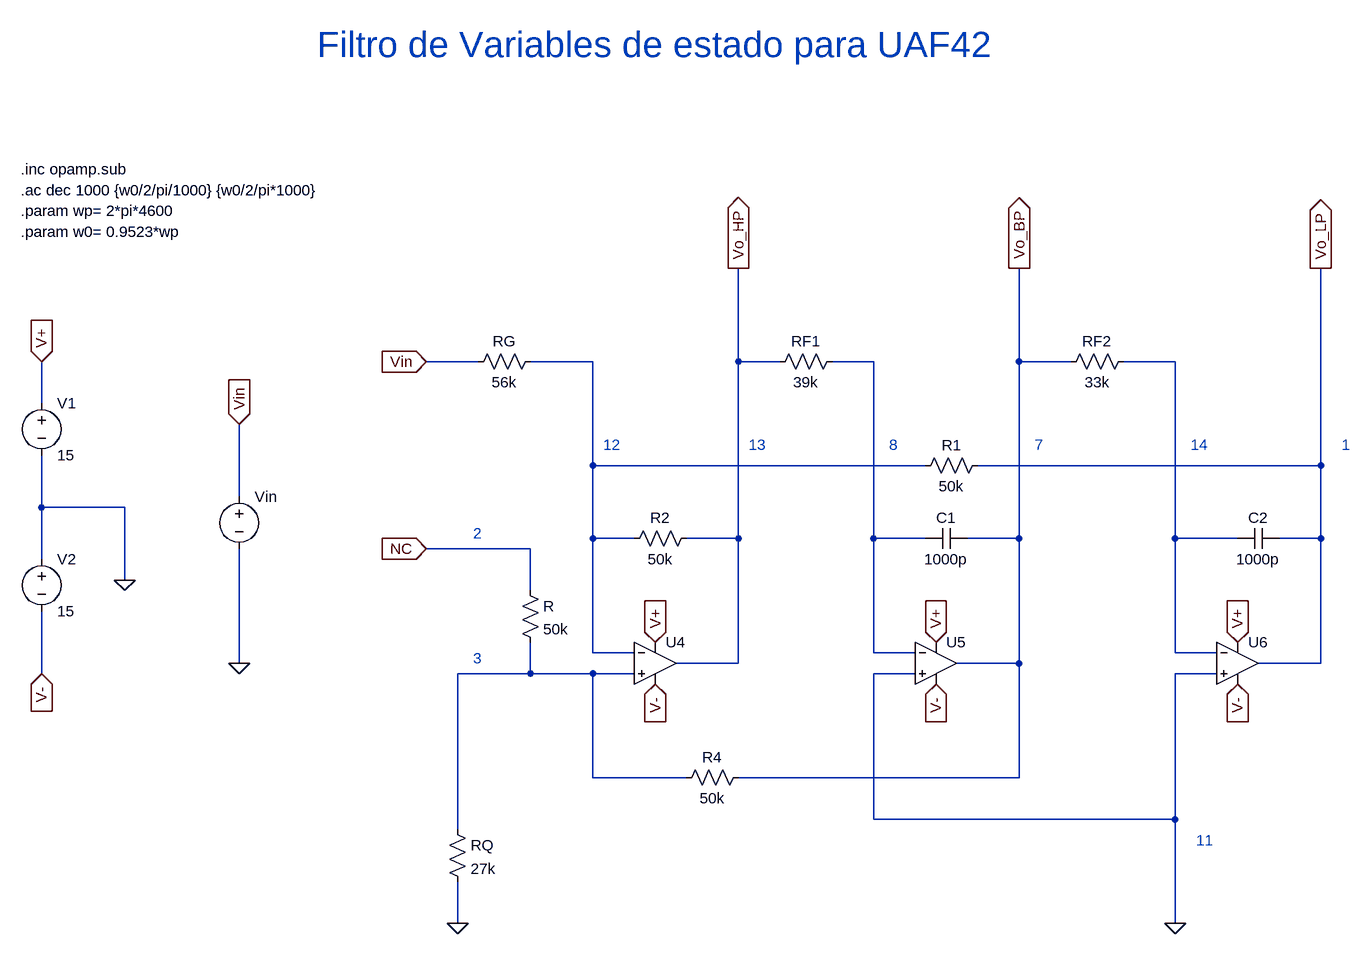
[diagram p0: schematic TPL1_Simulacion_Circuital_V1.2.asc]
TPL1_Simulacion_Circuital_V1.2.asc, the LTspice schematic file:
Version 4
SHEET 1 996 680
WIRE -1600 -512 -1680 -512
WIRE -1424 -512 -1520 -512
WIRE -1200 -512 -1200 -656
WIRE -1136 -512 -1200 -512
WIRE -992 -512 -1056 -512
WIRE -768 -512 -768 -656
WIRE -688 -512 -768 -512
WIRE -528 -512 -608 -512
WIRE -2272 -448 -2272 -512
WIRE -1424 -352 -1424 -512
WIRE -912 -352 -1424 -352
WIRE -304 -352 -304 -656
WIRE -304 -352 -832 -352
WIRE -1968 -304 -1968 -416
WIRE -2272 -288 -2272 -368
WIRE -2144 -288 -2272 -288
WIRE -1424 -240 -1424 -352
WIRE -1360 -240 -1424 -240
WIRE -1200 -240 -1200 -512
WIRE -1200 -240 -1280 -240
WIRE -992 -240 -992 -512
WIRE -912 -240 -992 -240
WIRE -768 -240 -768 -512
WIRE -768 -240 -848 -240
WIRE -528 -240 -528 -512
WIRE -432 -240 -528 -240
WIRE -304 -240 -304 -352
WIRE -304 -240 -368 -240
WIRE -1520 -224 -1680 -224
WIRE -2272 -208 -2272 -288
WIRE -2144 -176 -2144 -288
WIRE -1520 -160 -1520 -224
WIRE -1424 -64 -1424 -240
WIRE -1360 -64 -1424 -64
WIRE -992 -64 -992 -240
WIRE -928 -64 -992 -64
WIRE -528 -64 -528 -240
WIRE -464 -64 -528 -64
WIRE -1968 -48 -1968 -224
WIRE -1200 -48 -1200 -240
WIRE -1200 -48 -1296 -48
WIRE -768 -48 -768 -240
WIRE -768 -48 -864 -48
WIRE -304 -48 -304 -240
WIRE -304 -48 -400 -48
WIRE -2272 -32 -2272 -128
WIRE -1520 -32 -1520 -80
WIRE -1520 -32 -1632 -32
WIRE -1424 -32 -1520 -32
WIRE -1360 -32 -1424 -32
WIRE -928 -32 -992 -32
WIRE -464 -32 -528 -32
WIRE -1424 128 -1424 -32
WIRE -1280 128 -1424 128
WIRE -768 128 -768 -48
WIRE -768 128 -1200 128
WIRE -992 192 -992 -32
WIRE -528 192 -528 -32
WIRE -528 192 -992 192
WIRE -1632 208 -1632 -32
WIRE -1632 352 -1632 288
WIRE -528 352 -528 192
FLAG -1968 -48 0
FLAG -1632 352 0
FLAG -1680 -512 Vin
IOPIN -1680 -512 In
FLAG -1968 -416 Vin
IOPIN -1968 -416 In
FLAG -1200 -656 Vo_HP
IOPIN -1200 -656 Out
FLAG -768 -656 Vo_BP
IOPIN -768 -656 Out
FLAG -304 -656 Vo_LP
IOPIN -304 -656 Out
FLAG -528 352 0
FLAG -1680 -224 NC
IOPIN -1680 -224 In
FLAG -2144 -176 0
FLAG -2272 -512 V+
IOPIN -2272 -512 In
FLAG -2272 -32 V-
IOPIN -2272 -32 In
FLAG -1328 -80 V+
IOPIN -1328 -80 In
FLAG -896 -80 V+
IOPIN -896 -80 In
FLAG -432 -80 V+
IOPIN -432 -80 In
FLAG -1328 -16 V-
IOPIN -1328 -16 In
FLAG -896 -16 V-
IOPIN -896 -16 In
FLAG -432 -16 V-
IOPIN -432 -16 In
SYMBOL res -592 -528 R90
WINDOW 0 0 56 VBottom 2
WINDOW 3 32 56 VTop 2
SYMATTR InstName RF2
SYMATTR Value 33k
SYMBOL res -1264 -256 R90
WINDOW 0 0 56 VBottom 2
WINDOW 3 32 56 VTop 2
SYMATTR InstName R2
SYMATTR Value 50k
SYMBOL res -1040 -528 R90
WINDOW 0 0 56 VBottom 2
WINDOW 3 32 56 VTop 2
SYMATTR InstName RF1
SYMATTR Value 39k
SYMBOL cap -848 -256 R90
WINDOW 0 0 32 VBottom 2
WINDOW 3 32 32 VTop 2
SYMATTR InstName C1
SYMATTR Value 1000p
SYMBOL res -1184 112 R90
WINDOW 0 0 56 VBottom 2
WINDOW 3 32 56 VTop 2
SYMATTR InstName R4
SYMATTR Value 50k
SYMBOL cap -368 -256 R90
WINDOW 0 0 32 VBottom 2
WINDOW 3 32 32 VTop 2
SYMATTR InstName C2
SYMATTR Value 1000p
SYMBOL res -816 -368 R90
WINDOW 0 0 56 VBottom 2
WINDOW 3 32 56 VTop 2
SYMATTR InstName R1
SYMATTR Value 50k
SYMBOL res -1504 -528 R90
WINDOW 0 0 56 VBottom 2
WINDOW 3 32 56 VTop 2
SYMATTR InstName RG
SYMATTR Value 56k
SYMBOL voltage -1968 -320 R0
WINDOW 39 0 0 Left 2
SYMATTR Value2 AC 1
SYMATTR InstName Vin
SYMATTR Value ""
SYMBOL res -1648 192 R0
SYMATTR InstName RQ
SYMATTR Value 27k
SYMBOL res -1536 -176 R0
SYMATTR InstName R
SYMATTR Value 50k
SYMBOL Opamps\\UniversalOpamp -1328 -48 R0
SYMATTR InstName U4
SYMBOL Opamps\\UniversalOpamp -896 -48 R0
SYMATTR InstName U5
SYMBOL Opamps\\UniversalOpamp -432 -48 R0
SYMATTR InstName U6
SYMBOL voltage -2272 -464 R0
WINDOW 123 0 0 Left 0
WINDOW 39 0 0 Left 0
SYMATTR InstName V1
SYMATTR Value 15
SYMBOL voltage -2272 -224 R0
WINDOW 123 0 0 Left 0
WINDOW 39 0 0 Left 0
SYMATTR InstName V2
SYMATTR Value 15
TEXT -1848 -1000 Left 5 ;Filtro de Variables de estado para UAF42
TEXT -1608 -248 Left 2 ;2
TEXT -1608 -56 Left 2 ;3
TEXT -1408 -384 Left 2 ;12
TEXT -1184 -384 Left 2 ;13
TEXT -968 -384 Left 2 ;8
TEXT -744 -384 Left 2 ;7
TEXT -504 -384 Left 2 ;14
TEXT -272 -384 Left 2 ;1
TEXT -496 224 Left 2 ;11
TEXT -2304 -776 Left 2 !.ac dec 1000 {w0/2/pi/1000} {w0/2/pi*1000}
TEXT -2304 -808 Left 2 !.inc opamp.sub
TEXT -2304 -712 Left 2 !.param w0= 0.9523*wp
TEXT -2304 -744 Left 2 !.param wp= 2*pi*4600

The netlist it stands for:
* TPL1_Simulacion_Circuital_V1.2.asc
RF2 N003 Vo_BP 33k
R2 Vo_HP N001 50k
RF1 N002 Vo_HP 39k
C1 Vo_BP N002 1000p
R4 Vo_BP N004 50k
C2 Vo_LP N003 1000p
R1 Vo_LP N001 50k
RG N001 Vin 56k
Vin Vin 0 AC 1
RQ N004 0 27k
R NC N004 50k
XU4 N004 N001 V+ V- Vo_HP level1 Avol=1Meg GBW=10Meg Vos=0 En=0 Enk=0 In=0 Ink=0 Rin=500Meg  ; pins In+ In- V+ V- OUT
XU5 0 N002 V+ V- Vo_BP level1 Avol=1Meg GBW=10Meg Vos=0 En=0 Enk=0 In=0 Ink=0 Rin=500Meg  ; pins In+ In- V+ V- OUT
XU6 0 N003 V+ V- Vo_LP level1 Avol=1Meg GBW=10Meg Vos=0 En=0 Enk=0 In=0 Ink=0 Rin=500Meg  ; pins In+ In- V+ V- OUT
V1 V+ 0 15
V2 0 V- 15
* Filtro de Variables de estado para UAF42
* 2
* 3
* 12
* 13
* 8
* 7
* 14
* 1
* 11
.ac dec 1000 {w0/2/pi/1000} {w0/2/pi*1000}
.inc opamp.sub
.param w0= 0.9523*wp
.param wp= 2*pi*4600
.lib UniversalOpAmp1.lib
.backanno
.end